# Altium schematic sheet Alimentacao.SchDoc
size A4
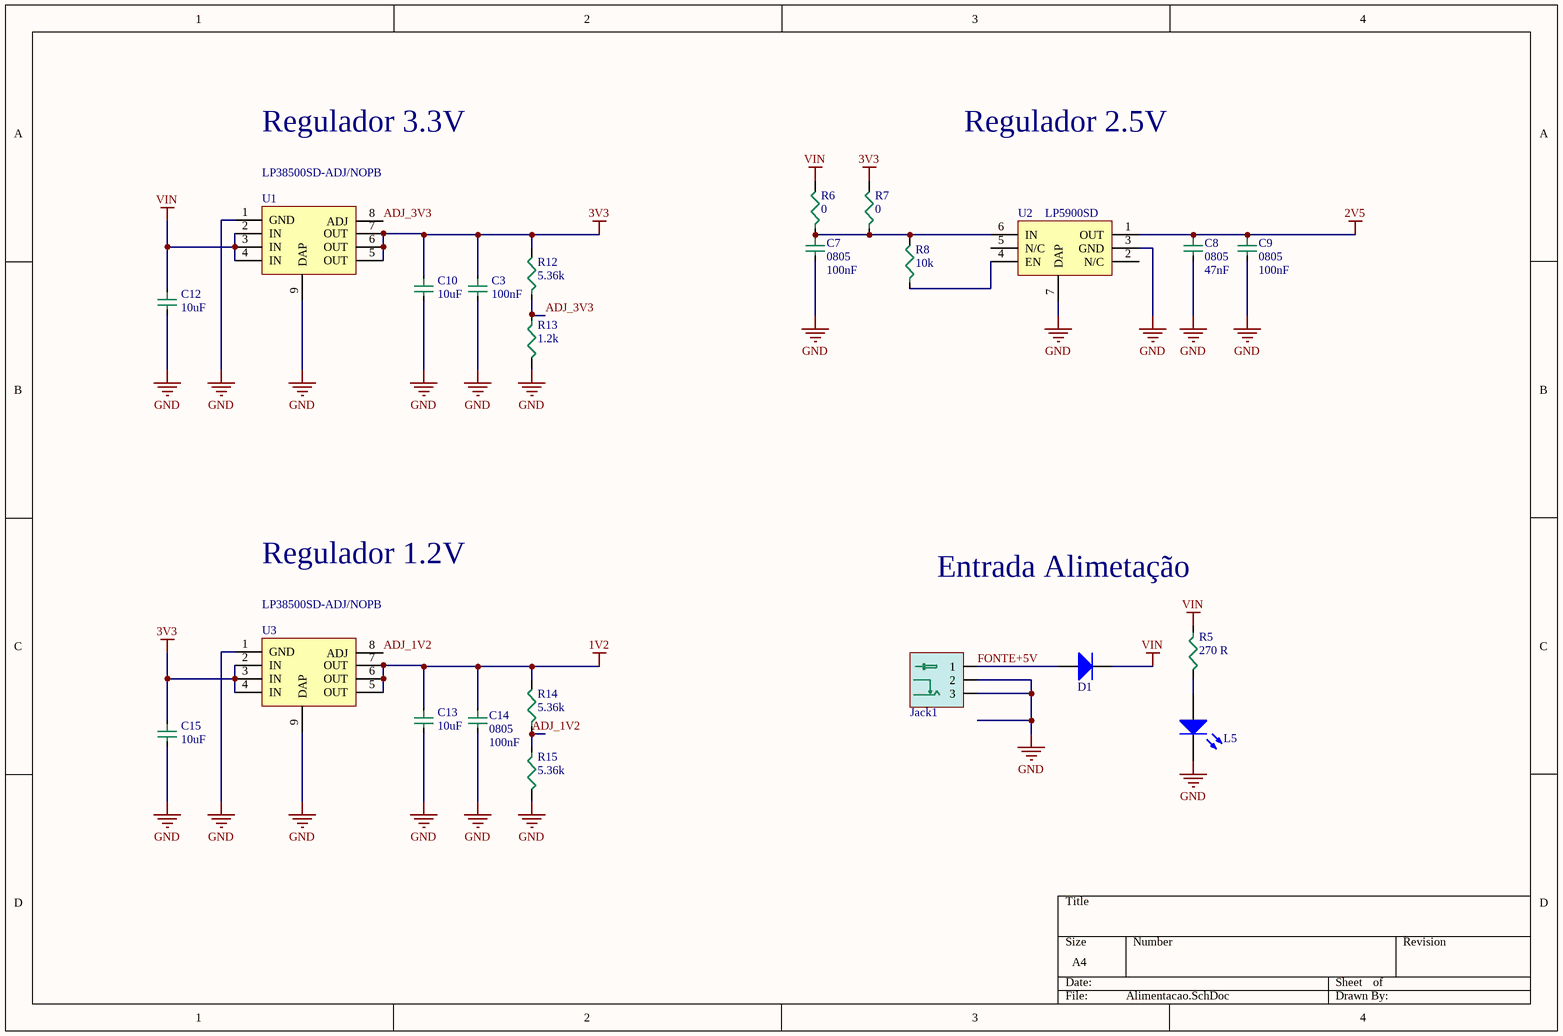
[diagram p0: Alimentacao.SchDoc]

## Parts
C3  value 100nF  [0603C]  (hidden comment: 0603)
C7  0805  value 100nF  [0603C]
C8  0805  value 47nF  [0603C]
C9  0805  value 100nF  [0603C]
C10  value 10uF  [0603C]  (hidden comment: 0603)
C12  value 10uF  [0603C]  (hidden comment: 0603)
C13  value 10uF  [0603C]  (hidden comment: 0603)
C14  0805  value 100nF  [0603C]
C15  value 10uF  [0603C]  (hidden comment: 0603)
D1  Diodo_1  [SOD123]  (value not drawn)
Jack1  DC Supply Jack  [CON_DC_POWER_JACK]  (value not drawn)
L5  LED 0805  [LED SMD 0603]  (value not drawn)
R5  value 270 R  [0603]  (hidden comment: 0805)
R6  value 0  [0603]  (hidden comment: 0805)
R7  value 0  [0603]  (hidden comment: 0805)
R8  value 10k  [0603]  (hidden comment: 0805)
R12  value 5.36k  [0603]  (hidden comment: 0805)
R13  value 1.2k  [0603]  (hidden comment: 0805)
R14  value 5.36k  [0603]  (hidden comment: 0805)
R15  value 5.36k  [0603]  (hidden comment: 0805)
U1  LP38500SD-ADJ/NOPB  [8-WFDFN]
U2  LP5900SD  [6-WFDFN]
U3  LP38500SD-ADJ/NOPB  [8-WFDFN]

## Nets
1V2: C13.1 C14.1 R14.2 U3.5(OUT) U3.6(OUT) U3.7(OUT)
2V5: C8.1 C9.1 U2.1(OUT)
3V3: C3.1 C10.1 C15.1 R7.2 R12.2 U1.5(OUT) U1.6(OUT) U1.7(OUT) U3.2(IN) U3.3(IN) U3.4(IN)
GND: C3.2 C7.2 C8.2 C9.2 C10.2 C12.2 C13.2 C14.2 C15.2 Jack1.2 Jack1.3 L5.2(K) R13.2 R15.2 U1.1(GND) U1.9(DAP) U2.3(GND) U2.7(DAP) U3.1(GND) U3.9(DAP)
VIN: C12.1 D1.2(K) R5.1 R6.2 U1.2(IN) U1.3(IN) U1.4(IN)
ADJ_1V2: R14.1 R15.1 U3.8(ADJ)
ADJ_3V3: R12.1 R13.1 U1.8(ADJ)
FONTE+5V: D1.1(A) Jack1.1
NetC7_1: C7.1 R6.1 R7.1 R8.2 U2.6(IN)
NetL5_1: L5.1(A) R5.2
NetR8_1: R8.1 U2.4(EN)

Not connected (* = marked no-connect by the designer): U2 2(N/C) 5(N/C)

## Notes on the sheet
- Regulador 3.3V
- Regulador 2.5V
- Regulador 1.2V
- Entrada Alimetação

## Library data of the parts
C3 C7-C10 C12-C15 = Capacitor SMD 0603
D1 = Diodo_1: DIODE SCHOTTKY 20V 0.5A SOD123; Supplier 1: Digi-Key; Supplier Part Number 1: MBR0520LCT-ND
Jack1 = DC_Power_connector
L5 = LED 0603 SMD: Typical INFRARED GaAs LED; Published: 8-Jun-2000; LatestRevisionDate: 08-Jul-2005; LatestRevisionNote: Mech Layer 1 removed.; PackageReference: LED-0; Publisher: Altium Limited
R5-R8 R12-R15 = Resistor SMD 0603 1/10 W: %: ±1%; P: 1/8W
U1 U3 = LP38500SD-ADJ/NOPB: 1.5-A Flexcap Low-Dropout Linear Regulator; Published: 26-Mar-2019; LatestRevisionDate: 26-Mar-2019; LatestRevisionNote: IPC-7351 Footprint Added.; DatasheetVersion: Sept-2015; PackageVersion: Nov-2007; PackageReference: e 8-WSON (3x2.5); Publisher: Altium Limited; PackageDescription: 8-WFDFN Exposed Pad; ComponentLink1Description: Manufacturer Link; ComponentLink1URL: http://www.ti.com/lit/ds/symlink/lp38500-adj.pdf
U2 = LP5900SD-2.5/NOPB: 1.5-A Flexcap Low-Dropout Linear Regulator; Published: 26-Mar-2019; LatestRevisionDate: 26-Mar-2019; LatestRevisionNote: IPC-7351 Footprint Added.; DatasheetVersion: june-2016; PackageVersion: Nov-2007; PackageReference: 6-WSON (3x2.5); Publisher: Altium Limited; PackageDescription: 6-WFDFN Exposed Pad; ComponentLink1Description: Manufacturer Link; ComponentLink1URL: http://www.ti.com/lit/ds/symlink/lp38500-adj.pdf